# EAGLE design EXM Encoder - Rev A1 (EAGLE 7.7.0)
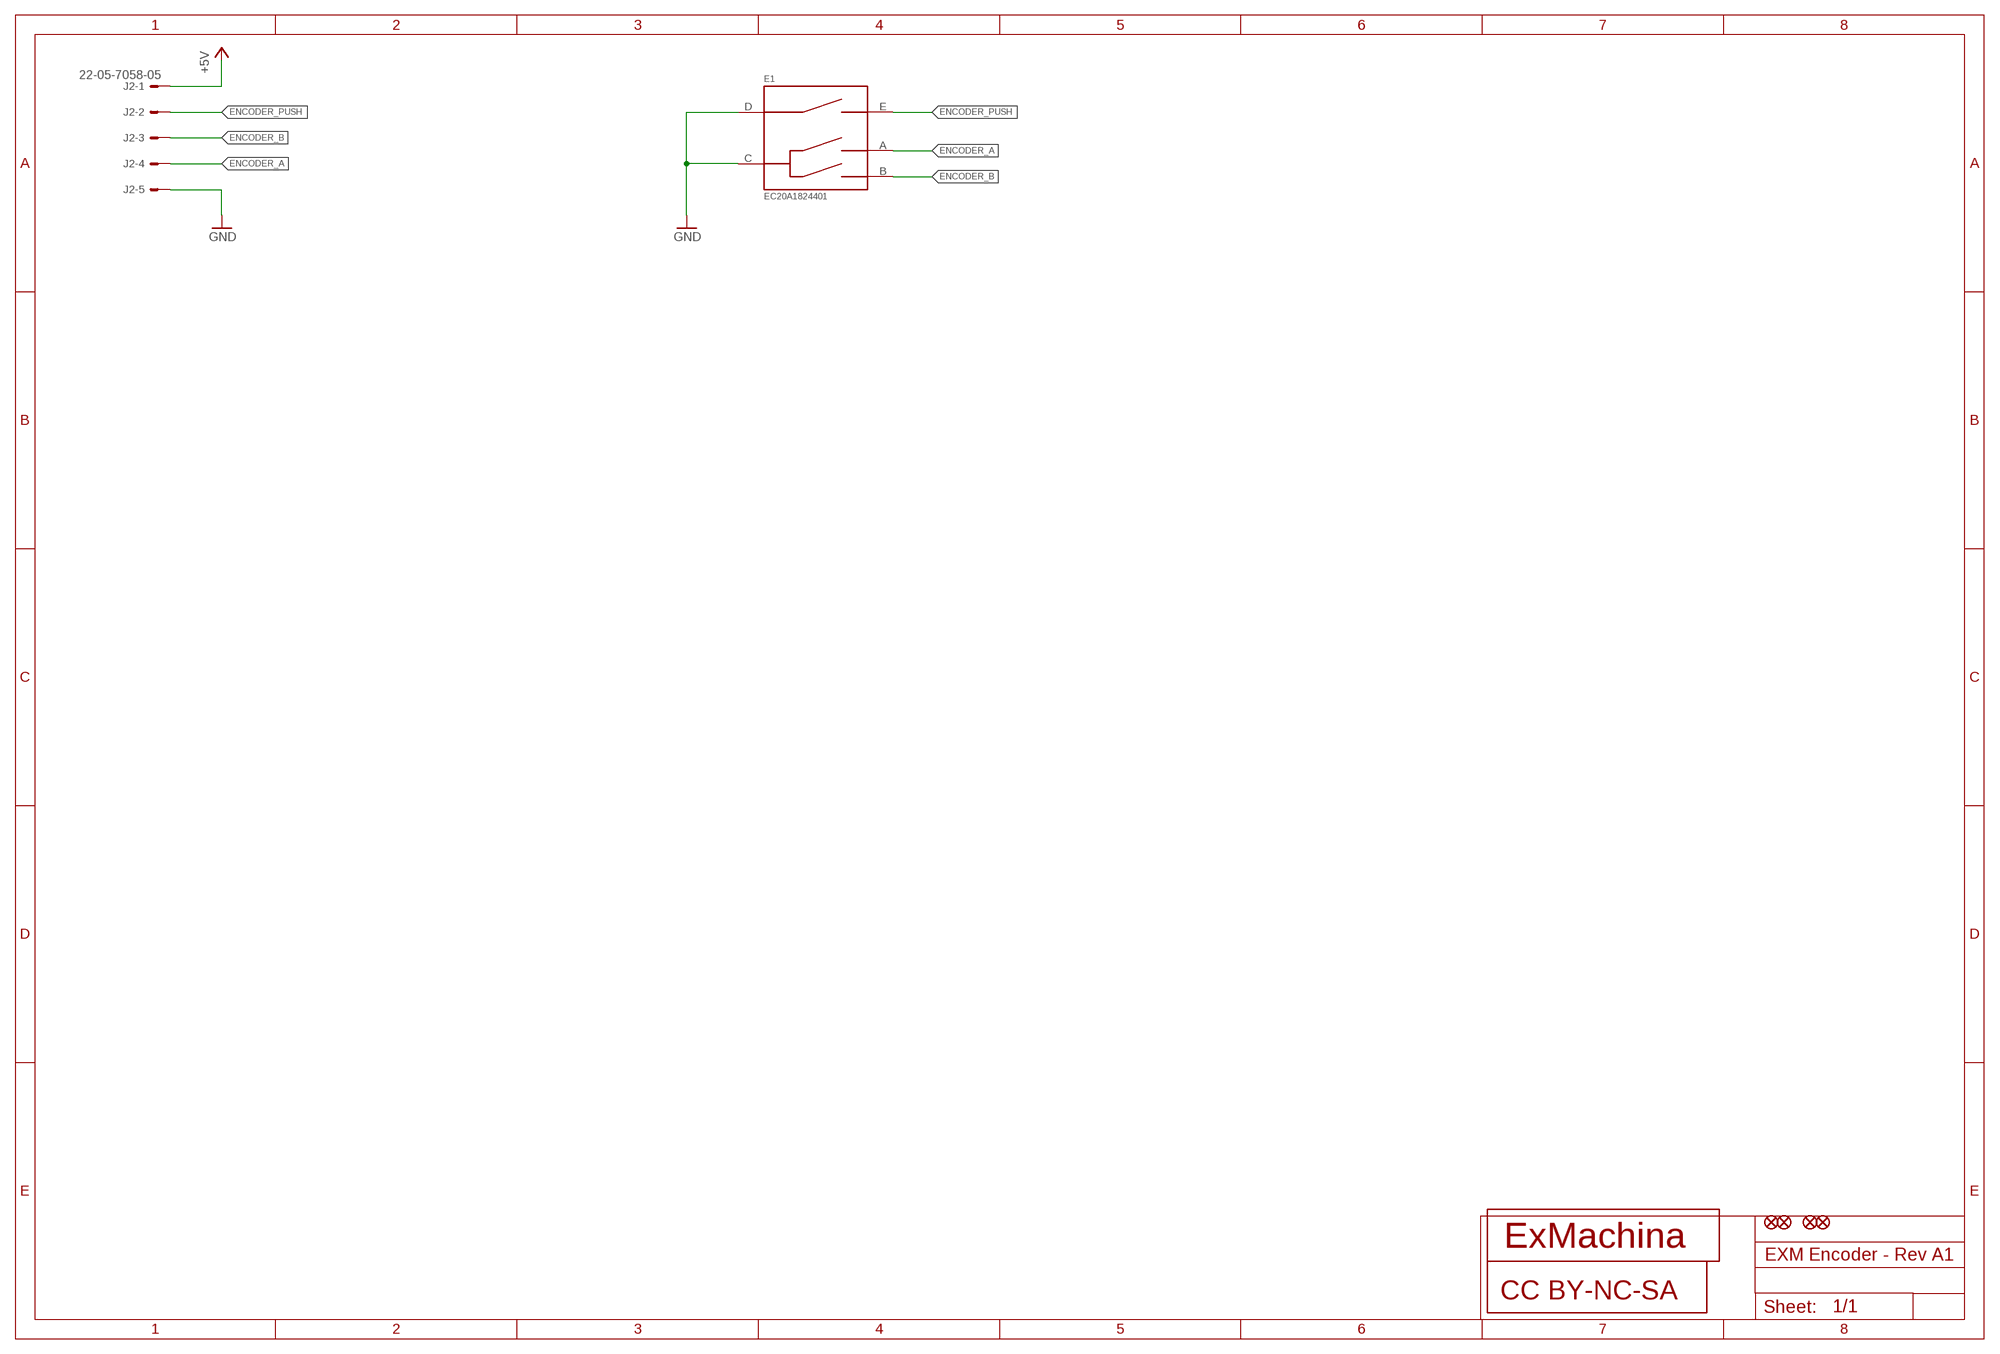
[diagram p0: schematic, sheet 1]

## Parts
CC1  CC-BY-NC-SA  [CC-BY-NC-SA]
E1  EC20A1824401  [EC20A]
J2  22-05-7058-05  [7395-05]
JP1  FIDUCIAL1X2  [FIDUCIAL-1X2]
JP2  FIDUCIAL1X2  [FIDUCIAL-1X2]
JP3  FIDUCIAL1X2  [FIDUCIAL-1X2]
JP4  FIDUCIAL1X2  [FIDUCIAL-1X2]
T1  EXMACHINA-LOGO-NAME  [EXM-LOGO-BASELINE]

## Nets
+5V: J2.1
ENCODER_A: E1.A(ENCODER_A) J2.4
ENCODER_B: E1.B(ENCODER_B) J2.3
ENCODER_PUSH: E1.E(PUSH) J2.2
GND: E1.C(COM) E1.D(COM_PUSH) J2.5

## Library data of the parts
CC1 = cc-by-sa:CC-BY-NC-SA
E1 = encoder:EC20A
J2 = con-molex:22-?-05: CONNECTOR wire to board 2.54 mm (.1 inch) pitch header; OC_FARNELL: unknown; OC_NEWARK: unknown
JP1-JP4 = SparkFun:FIDUCIAL: Fiducial Alignment Points Various fiducial points for machine vision alignment.
T1 = exmachina:EXMACHINA-LOGO

## Board
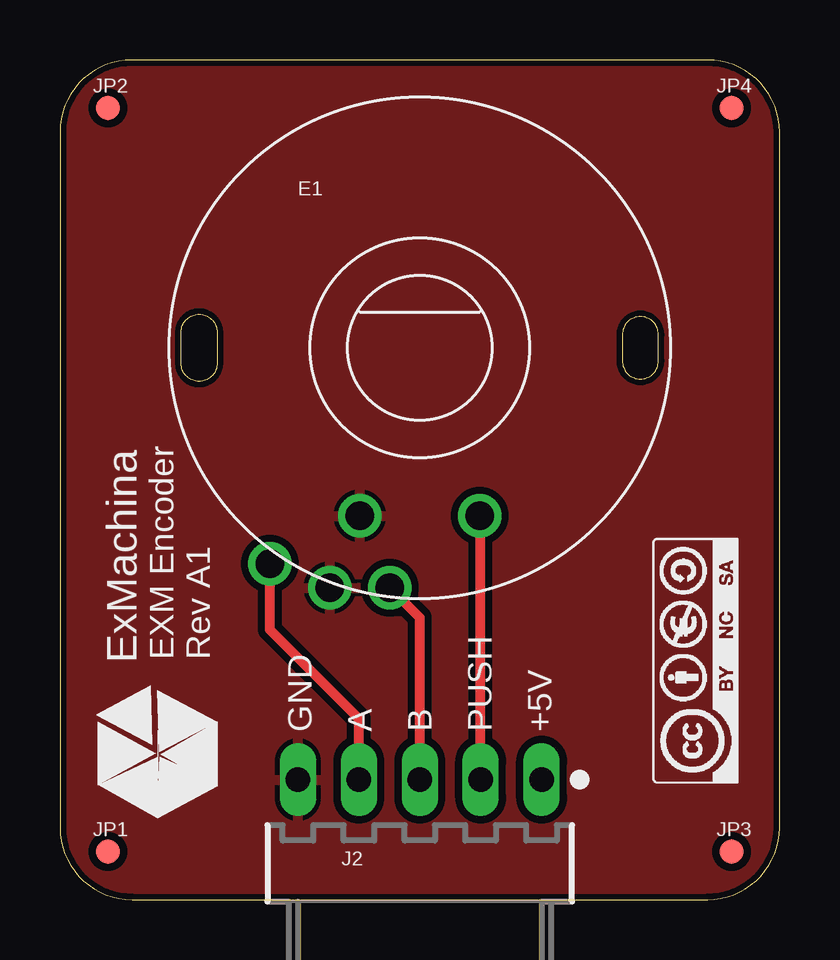
[diagram p1: board, top side]
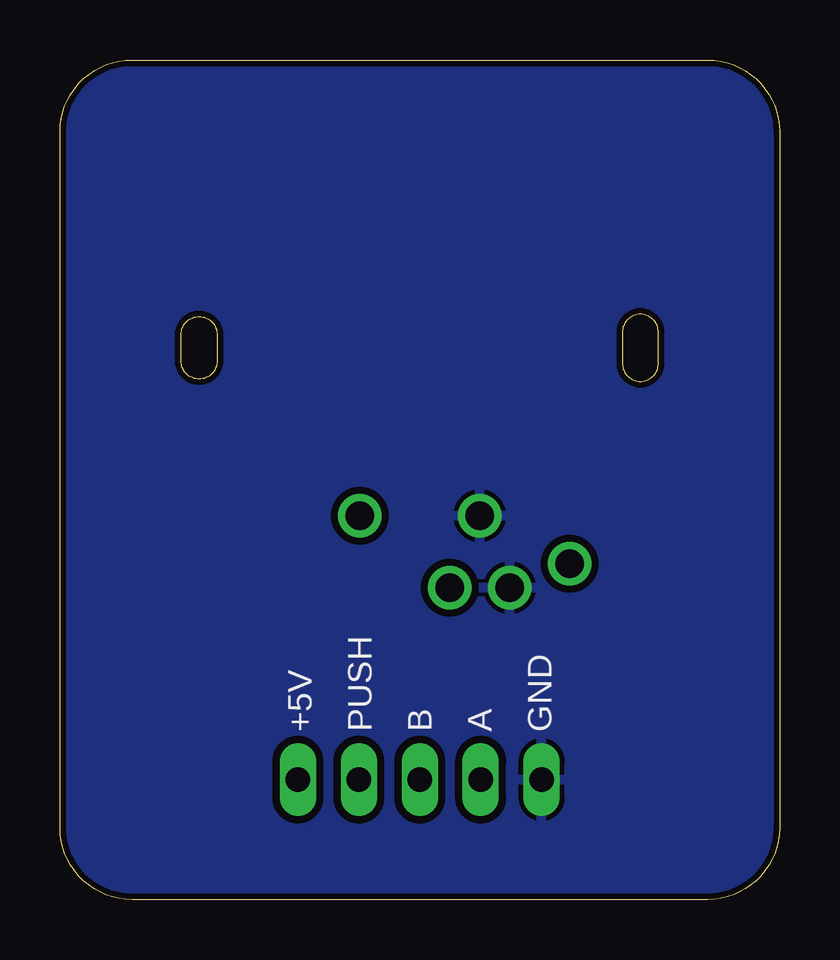
[diagram p2: board, bottom side, seen from below]

Size 30 x 35 mm. Coordinates in mm from the lower left corner, seen from the top.
Outline: 30,3 30,32 arc90 27,35 3,35 arc90 0,32 0,3 arc90 3,0 27,0 arc90 30,3
Copper layers (1*16): Top 0.105mm / dielectric 1.55mm / Bottom 0.105mm
Design rules "eC_2Layer_PClass3_BaseCopperO105": minimum track width 0.25mm, minimum drill 0.35mm, track to track 0.3mm, track to pad 0.3mm, pad to pad 0.3mm, via to via 0.3mm, smd to smd 0mil, copper to edge 0.25mm, drill to drill 0.35mm, minimum pad ring 0.25mm, minimum via ring 0.2mm, stop-mask expansion 0mil, vias tented up to drill 0.45mm, thermal gap 0.2mm

### Footprints (pad centres in the part's own frame; a part is rotated, then mirrored left to right if it is on the bottom)
EC20A = drill 1.2: A -6.25,-9; B -1.25,-10; C -3.75,-10; D -2.5,-7; E 2.5,-7
7395-05 = drill 1.016 long: 1 5.08,0; 2 2.54,0; 3 0,0; 4 -2.54,0; 5 -5.08,0
FIDUCIAL-1X2 = smd 1 x 1: 1 0,0

### Placement (x,y rotation side)
CC1  26.52,9.95 90 top
E1  15,23 0 top
J2  15,5 0 top
JP1  2,2 0 top
JP2  2,33 0 top
JP3  28,2 0 top
JP4  28,33 0 top
T1  4.1,6.06 90 top

### Tracks (layer width: path | path; a pad name or v marks a point on that pad's centre or on a via)
ENCODER_A
  Top 0.406: J2.4 12.46,7.54 8.75,11.25 E1.A
ENCODER_B
  Top 0.406: J2.3 15,11.75 E1.B
ENCODER_PUSH
  Top 0.406: J2.2 17.54,15.96 E1.E
GND
  pour Top: -2,37 32,37 32,-2 -2,-2
  pour Bottom: -1,36 31,36 31,-1 -1,-1

### Text on the board
tPlace: EXM Encoder / Rev A1 | GND | A | B | PUSH | +5V
bPlace: GND | A | B | PUSH | +5V